# EAGLE design Decoder_35 (EAGLE 9.0.1)
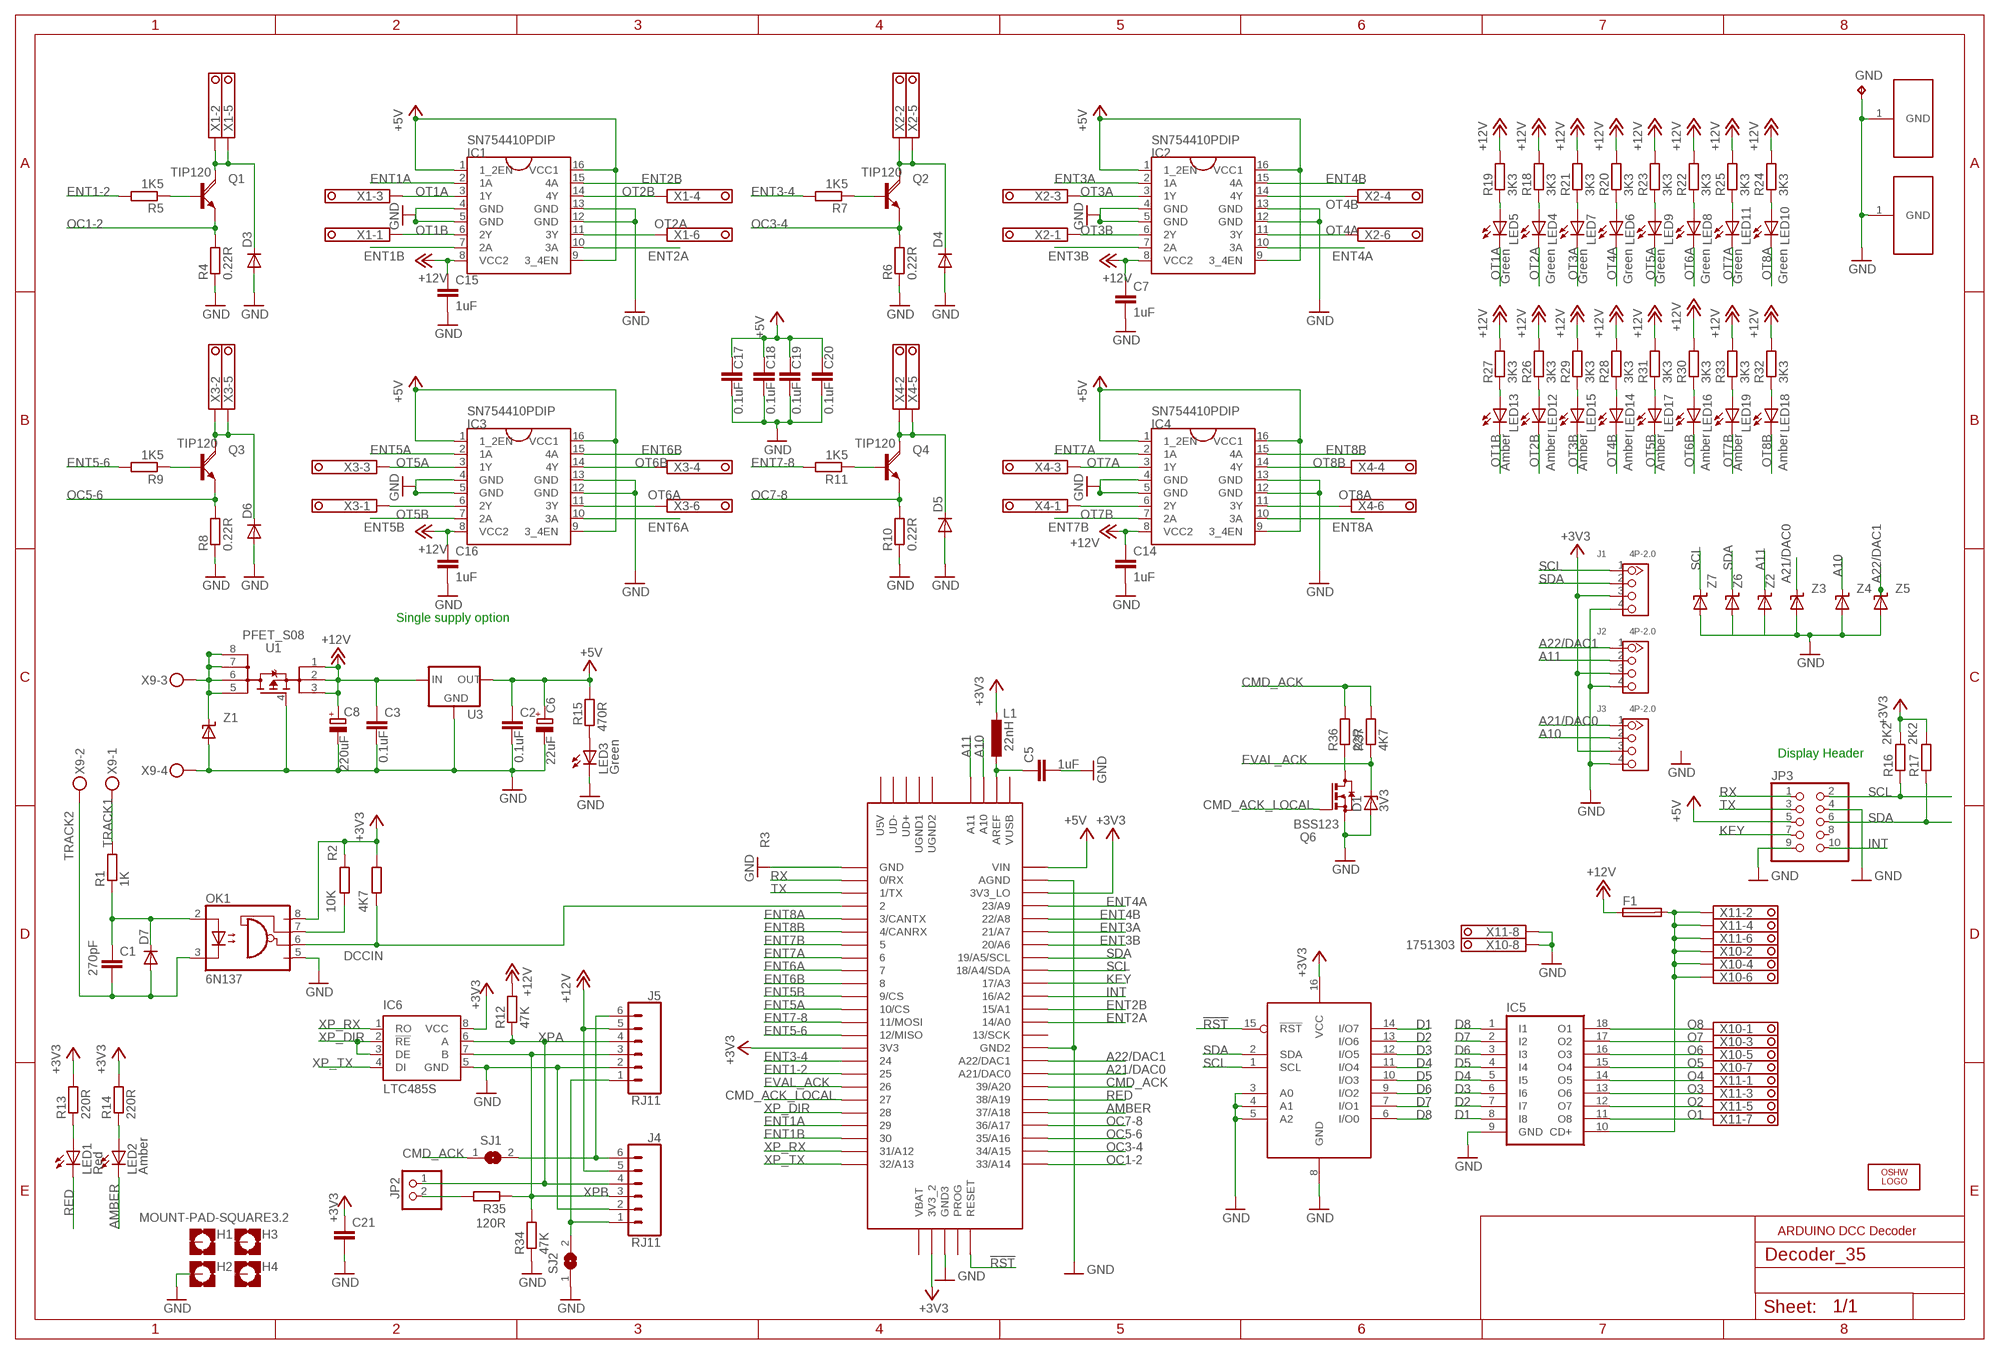
[diagram p0: schematic, sheet 1]

## Parts
C1  270pF  C-EUC0805  [C0805]
C2  0.1uF  C-EUC0805  [C0805]
C3  0.1uF  C-EUC0805  [C0805]
C5  1uF  C-EUC0805  [C0805]
C6  22uF  CPOL-EUE2.5-5  [E2,5-5]
C7  1uF  C-EUC0805  [C0805]
C8  220uF  CPOL-EUE5-8.5  [E5-8,5]
C14  1uF  C-EUC0805  [C0805]
C15  1uF  C-EUC0805  [C0805]
C16  1uF  C-EUC0805  [C0805]
C17  0.1uF  C-EUC0805  [C0805]
C18  0.1uF  C-EUC0805  [C0805]
C19  0.1uF  C-EUC0805  [C0805]
C20  0.1uF  C-EUC0805  [C0805]
C21  C-EUC0805  [C0805]
D1  3V3  ZENER-DIODESOT23  [SOT23]
D3  CGRM4002-G  [SOD-123_MINI-SMA]
D4  CGRM4002-G  [SOD-123_MINI-SMA]
D5  CGRM4002-G  [SOD-123_MINI-SMA]
D6  CGRM4002-G  [SOD-123_MINI-SMA]
D7  CGRM4002-G  [SOD-123_MINI-SMA]
F1  SMD_FUSE  [1812]
GND  TPB2,54  [B2,54]
H1  MOUNT-PAD-SQUARE3.2  [3,2-PAD-SQUARE]
H2  MOUNT-PAD-SQUARE3.2  [3,2-PAD-SQUARE]
H3  MOUNT-PAD-SQUARE3.2  [3,2-PAD-SQUARE]
H4  MOUNT-PAD-SQUARE3.2  [3,2-PAD-SQUARE]
IC1  SN754410PDIP  [DIL16]
IC2  SN754410PDIP  [DIL16]
IC3  SN754410PDIP  [DIL16]
IC4  SN754410PDIP  [DIL16]
IC5  ULN2803A  [DIL18]
IC6  LTC485S  [SOIC8]
J1  4P-2.0  GROVE-CONNECTOR-DIP(4P-2.0)  [HW4-2.0]
J2  4P-2.0  GROVE-CONNECTOR-DIP(4P-2.0)  [HW4-2.0]
J3  4P-2.0  GROVE-CONNECTOR-DIP(4P-2.0)  [HW4-2.0]
J4  RJ11  RJ11-6  [RJ11-6]
J5  RJ11  RJ11-6  [RJ11-6]
JP2  PINHD-1X2  [1X02]
JP3  PINHD-2X5  [2X05]
L1  22nH  L-EUL2012C  [L2012C]
LED1  Red  LED3MM  [LED3MM]
LED2  Amber  LED3MM  [LED3MM]
LED3  Green  LED3MM  [LED3MM]
LED4  Green  LED3MM  [LED3MM]
LED5  Green  LED3MM  [LED3MM]
LED6  Green  LED3MM  [LED3MM]
LED7  Green  LED3MM  [LED3MM]
LED8  Green  LED3MM  [LED3MM]
LED9  Green  LED3MM  [LED3MM]
LED10  Green  LED3MM  [LED3MM]
LED11  Green  LED3MM  [LED3MM]
LED12  Amber  LED3MM  [LED3MM]
LED13  Amber  LED3MM  [LED3MM]
LED14  Amber  LED3MM  [LED3MM]
LED15  Amber  LED3MM  [LED3MM]
LED16  Amber  LED3MM  [LED3MM]
LED17  Amber  LED3MM  [LED3MM]
LED18  Amber  LED3MM  [LED3MM]
LED19  Amber  LED3MM  [LED3MM]
LOGO1  OSHW_LOGO_6MILX0200-NT  [OSHW_6X200_NOTEXT]
MT1  DINC45_MOUNT  [DIN_C45]
MT2  DINC45_MOUNT  [DIN_C45]
OK1  6N137  [DIL08]
Q1  TIP120  [TO220AH]
Q2  TIP120  [TO220AH]
Q3  TIP120  [TO220AH]
Q4  TIP120  [TO220AH]
Q6  BSS123  [SOT23]
R1  1K  R-EU_R0805  [R0805]
R2  10K  R-EU_R0805  [R0805]
R3  4K7  R-EU_R0805  [R0805]
R4  0.22R  R-EU_R2512  [R2512]
R5  1K5  R-EU_R0805  [R0805]
R6  0.22R  R-EU_R2512  [R2512]
R7  1K5  R-EU_R0805  [R0805]
R8  0.22R  R-EU_R2512  [R2512]
R9  1K5  R-EU_R0805  [R0805]
R10  0.22R  R-EU_R2512  [R2512]
R11  1K5  R-EU_R0805  [R0805]
R12  47K  R-EU_R0805  [R0805]
R13  220R  R-EU_R0805  [R0805]
R14  220R  R-EU_R0805  [R0805]
R15  470R  R-EU_R0805  [R0805]
R16  2K2  R-EU_R0805  [R0805]
R17  2K2  R-EU_R0805  [R0805]
R18  3K3  R-EU_R0805  [R0805]
R19  3K3  R-EU_R0805  [R0805]
R20  3K3  R-EU_R0805  [R0805]
R21  3K3  R-EU_R0805  [R0805]
R22  3K3  R-EU_R0805  [R0805]
R23  3K3  R-EU_R0805  [R0805]
R24  3K3  R-EU_R0805  [R0805]
R25  3K3  R-EU_R0805  [R0805]
R26  3K3  R-EU_R0805  [R0805]
R27  3K3  R-EU_R0805  [R0805]
R28  3K3  R-EU_R0805  [R0805]
R29  3K3  R-EU_R0805  [R0805]
R30  3K3  R-EU_R0805  [R0805]
R31  3K3  R-EU_R0805  [R0805]
R32  3K3  R-EU_R0805  [R0805]
R33  3K3  R-EU_R0805  [R0805]
R34  47K  R-EU_R0805  [R0805]
R35  120R  R-EU_R0805  [R0805]
R36  22R  R-EU_R0805  [R0805]
R37  4K7  R-EU_R0805  [R0805]
SJ1  SJ  [SJ]
SJ2  SJ  [SJ]
U1  PFET_S08  [SO08]
U2  PCA9557  [S016]
U3  V_REG_78XX-TO-220  [TO-220-ALT]
U$1  TEENSY_3.5/3.6  [TEENSY_3.5/3.6]
X1  1751280  [1751280]
X2  1751280  [1751280]
X3  1751280  [1751280]
X4  1751280  [1751280]
X9  MKDSN1,5/4-5,08  [MKDSN1,5/4-5,08]
X10  1751303  [1751303]
X11  1751303  [1751303]
Z1  TRANSZORB  [SMB]
Z2  TRANSZORB-SMA  [SMA]
Z3  TRANSZORB-SMA  [SMA]
Z4  TRANSZORB-SMA  [SMA]
Z5  TRANSZORB-SMA  [SMA]
Z6  TRANSZORB-SMA  [SMA]
Z7  TRANSZORB-SMA  [SMA]

## Nets
!RST: U2.15(!RST) U$1.RESET
+3V3 [pwr]: C21.1 IC6.8(VCC) J1.3 J2.3 J3.3 L1.1 OK1.8(VCC) R2.2 R3.2 R13.2 R14.2 R16.2 R17.2 U2.16(VCC) U$1.3V3 U$1.3V3_2 U$1.3V3_LO
+5V: C2.1 C6.+ C17.1 C18.1 C19.1 C20.1 IC1.1(1_2EN) IC1.9(3_4EN) IC1.16(VCC1) IC2.1(1_2EN) IC2.9(3_4EN) IC2.16(VCC1) IC3.1(1_2EN) IC3.9(3_4EN) IC3.16(VCC1) IC4.1(1_2EN) IC4.9(3_4EN) IC4.16(VCC1) JP3.5 R15.2 U3.OUT U$1.VIN
+12V: C3.1 C7.1 C8.+ C14.1 C15.1 C16.1 F1.1 IC1.8(VCC2) IC2.8(VCC2) IC3.8(VCC2) IC4.8(VCC2) J4.5 J5.5 R12.2 R18.2 R19.2 R20.2 R21.2 R22.2 R23.2 R24.2 R25.2 R26.2 R27.2 R28.2 R29.2 R30.2 R31.2 R32.2 R33.2 U1.1(S1) U1.2(S2) U1.3(S3) U3.IN
A10: J3.2 U$1.A10 Z4.C
A11: J2.2 U$1.A11 Z2.C
A21/DAC0: J3.1 U$1.21/DAC0(A21/DAC0) Z3.C
A22/DAC1: J2.1 U$1.A22/DAC1 Z5.C
AMBER: LED2.K(C) U$1.37/A18
CMD_ACK: R36.2 R37.2 SJ1.1 U$1.39/A20
CMD_ACK_LOCAL: Q6.1(G) U$1.27
D1: IC5.8(I8) U2.14(I/O7)
D2: IC5.7(I7) U2.13(I/O6)
D3: IC5.6(I6) U2.12(I/O5)
D4: IC5.5(I5) U2.11(I/O4)
D5: IC5.4(I4) U2.10(I/O3)
D6: IC5.3(I3) U2.9(I/O2)
D7: IC5.2(I2) U2.7(I/O1)
D8: IC5.1(I1) U2.6(I/O0)
DCCIN: OK1.6(VO) R3.1 U$1.2
ENT1-2: R5.2 U$1.25
ENT1A: IC1.2(1A) U$1.29
ENT1B: IC1.7(2A) U$1.30
ENT2A: IC1.10(3A) U$1.14/A0
ENT2B: IC1.15(4A) U$1.15/A1
ENT3-4: R7.2 U$1.24
ENT3A: IC2.2(1A) U$1.21/A7
ENT3B: IC2.7(2A) U$1.20/A6
ENT4A: IC2.10(3A) U$1.23/A9
ENT4B: IC2.15(4A) U$1.22/A8
ENT5-6: R9.2 U$1.12/MISO
ENT5A: IC3.2(1A) U$1.10/CS
ENT5B: IC3.7(2A) U$1.9/CS
ENT6A: IC3.10(3A) U$1.7
ENT6B: IC3.15(4A) U$1.8
ENT7-8: R11.2 U$1.11/MOSI
ENT7A: IC4.2(1A) U$1.6
ENT7B: IC4.7(2A) U$1.5
ENT8A: IC4.10(3A) U$1.3/CANTX
ENT8B: IC4.15(4A) U$1.4/CANRX
EVAL_ACK: D1.3(C) R37.1 U$1.26
GND: C2.2 C3.2 C5.2 C6.- C7.2 C8.- C14.2 C15.2 C16.2 C17.2 C18.2 C19.2 C20.2 C21.2 D1.1(A) D3.A D4.A D5.A D6.A GND.TP H2.B3,2(MOUNT) IC1.4(GND) IC1.5(GND) IC1.12(GND) IC1.13(GND) IC2.4(GND) IC2.5(GND) IC2.12(GND) IC2.13(GND) IC3.4(GND) IC3.5(GND) IC3.12(GND) IC3.13(GND) IC4.4(GND) IC4.5(GND) IC4.12(GND) IC4.13(GND) IC5.9(GND) IC6.5(GND) J1.4 J2.4 J3.4 J4.2 J5.2 JP3.4 JP3.9 LED3.K(C) MT1.1(GND) MT2.1(GND) OK1.5(GND) Q6.2(S) R4.1 R6.1 R8.1 R10.1 R34.1 SJ2.1 U1.4(G) U2.3(A0) U2.4(A1) U2.5(A2) U2.8(GND) U3.GND U$1.AGND U$1.GND U$1.GND2 U$1.GND3 X9.4 X10.8 X11.8 Z1.2(A) Z2.A Z3.A Z4.A Z5.A Z6.A Z7.A
INT: JP3.10 U$1.16/A2
KEY: JP3.7 U$1.17/A3
N$1: C5.1 L1.2 U$1.AREF
N$2: C1.1 D7.C OK1.2(A) R1.1
N$3: U1.5(D4) U1.6(D3) U1.7(D2) U1.8(D1) X9.3 Z1.1(C)
N$4: OK1.7(VE) R2.1
N$5: Q2.B R7.1
N$7: Q1.B R5.1
N$8: D3.C Q1.C X1.2 X1.5
N$9: LED5.A R19.1
N$10: J4.1 J5.1 SJ2.2
N$11: Q6.3(D) R36.1
N$12: D4.C Q2.C X2.2 X2.5
N$13: LED6.A R20.1
N$14: LED7.A R21.1
N$15: LED8.A R22.1
N$16: LED9.A R23.1
N$17: LED10.A R24.1
N$18: LED11.A R25.1
N$19: LED12.A R26.1
N$20: Q3.B R9.1
N$22: D6.C Q3.C X3.2 X3.5
N$23: LED13.A R27.1
N$24: LED14.A R28.1
N$25: LED15.A R29.1
N$26: LED16.A R30.1
N$27: Q4.B R11.1
N$28: J4.6 J5.6 SJ1.2
N$29: D5.C Q4.C X4.2 X4.5
N$30: LED17.A R31.1
N$31: LED18.A R32.1
N$32: LED19.A R33.1
N$33: JP2.2 R35.2
N$38: F1.2 IC5.10(CD+) X10.2 X10.4 X10.6 X11.2 X11.4 X11.6
N$42: LED3.A R15.1
N$43: LED1.A R13.1
N$44: LED2.A R14.1
N$47: LED4.A R18.1
O1: IC5.11(O8) X11.7
O2: IC5.12(O7) X11.5
O3: IC5.13(O6) X11.3
O4: IC5.14(O5) X11.1
O5: IC5.15(O4) X10.7
O6: IC5.16(O3) X10.5
O7: IC5.17(O2) X10.3
O8: IC5.18(O1) X10.1
OC1-2: Q1.E R4.2 U$1.33/A14
OC3-4: Q2.E R6.2 U$1.34/A15
OC5-6: Q3.E R8.2 U$1.35/A16
OC7-8: Q4.E R10.2 U$1.36/A17
OT1A: IC1.3(1Y) LED5.K(C) X1.3
OT1B: IC1.6(2Y) LED13.K(C) X1.1
OT2A: IC1.11(3Y) LED4.K(C) X1.6
OT2B: IC1.14(4Y) LED12.K(C) X1.4
OT3A: IC2.3(1Y) LED7.K(C) X2.3
OT3B: IC2.6(2Y) LED15.K(C) X2.1
OT4A: IC2.11(3Y) LED6.K(C) X2.6
OT4B: IC2.14(4Y) LED14.K(C) X2.4
OT5A: IC3.3(1Y) LED9.K(C) X3.3
OT5B: IC3.6(2Y) LED17.K(C) X3.1
OT6A: IC3.11(3Y) LED8.K(C) X3.6
OT6B: IC3.14(4Y) LED16.K(C) X3.4
OT7A: IC4.3(1Y) LED11.K(C) X4.3
OT7B: IC4.6(2Y) LED19.K(C) X4.1
OT8A: IC4.11(3Y) LED10.K(C) X4.6
OT8B: IC4.14(4Y) LED18.K(C) X4.4
RED: LED1.K(C) U$1.38/A19
RX: JP3.1 U$1.0/RX
SCL: J1.1 JP3.2 R16.1 U2.1(SCL) U$1.18/A4/SDA Z7.C
SDA: J1.2 JP3.6 R17.1 U2.2(SDA) U$1.19/A5/SCL Z6.C
TRACK1: R1.2 X9.1
TRACK2: C1.2 D7.A OK1.3(C) X9.2
TX: JP3.3 U$1.1/TX
XP_DIR: IC6.2(!RE) IC6.3(DE) U$1.28
XP_RX: IC6.1(RO) U$1.31/A12
XP_TX: IC6.4(DI) U$1.32/A13
XPA: IC6.6(A) J4.4 J5.4 JP2.1 R12.1
XPB: IC6.7(B) J4.3 J5.3 R34.2 R35.1
Unconnected: H1.B3,2(MOUNT) H3.B3,2(MOUNT) H4.B3,2(MOUNT) JP3.8 U$1.13/SCK U$1.PROG U$1.U5V U$1.UD+ U$1.UD- U$1.UGND1 U$1.UGND2 U$1.VBAT U$1.VUSB

## Notes on the sheet
- Single supply option
- Display Header
- ARDUINO DCC Decoder

## Library data of the parts
C1-C3 C5 C7 C14-C20 = rcl:C-EU: CAPACITOR, European symbol; SPICEPREFIX: C
C6 C8 = rcl:CPOL-EU: POLARIZED CAPACITOR, European symbol; SPICEPREFIX: C
C21 = rcl:C-EU: CAPACITOR, European symbol
D1 = diode:ZENER-DIODE: Z-Diode
D3-D7 = diode:CGRM400*-G: Molded plasitc,JEDEC SOD-123/Mini SMA Source: Comchip CGRM4001-G.pdf
F1 = GJR:SMD_FUSE: SMD Resettable Fuse; FARNELL: 1597001; MANUFACTURER: Littelfuse; RATING: 500mA
GND = testpad:TP: Test pad
H1-H4 = holes:MOUNT-PAD-SQUARE: MOUNTING PAD, square
IC1-IC4 = AlexW-Eagle-Libraries:SN754410
IC5 = uln-udn:ULN2803A: DRIVER ARRAY
IC6 = linear-technology:LTC485: Low Power RS485 Interface Transceiver Source: http://www.linear.com/pc/downloadDocument.do?navId=H0,C1,C1007,C1017,P2064,D1718; OC_FARNELL: unknown; OC_NEWARK: unknown
J1-J3 = Seeed-Connector:GROVE-CONNECTOR-DIP(4P-2.0): 320110033
J4 J5 = SparkFun-Connectors:RJ11-6: RJ11 Jack - 6 pin Commonly found on CAT3 devices and some Microchip programmers. Here is the connector we sell at SparkFun: RJ11 6-Pin Connector <https://www.sparkfun.com/products/132> (PRT-00132) Datasheet <http://www.sparkfun.com/datasheets/Prototyping/Connectors/RJ11-Datasheet.pdf> It is used on this SparkFun product: SparkFun Weather Shield <https://www.sparkfun.com/products/12081> (DEV-12081) Weather Meters <https://www.sparkfun.com/products/8942> (SEN-08942); PROD_ID: CONN-08590; SF_ID: PRT-00132
JP2 = pinhead:PINHD-1X2: PIN HEADER
JP3 = pinhead:PINHD-2X5: PIN HEADER
L1 = rcl:L-EU: INDUCTOR, European symbol; SPICEPREFIX: L
LED1-LED19 = adafruit:LED: LED OSRAM: - CHIPLED LG R971, LG N971, LY N971, LG Q971, LY Q971, LO R971, LY R971 LH N974, LH R974 LS Q976, LO Q976, LY Q976 LO Q996 - Hyper CHIPLED LW Q18S LB Q993, LB Q99A, LB R99A - SideLED LS A670, LO A670, LY A670, LG A670, LP A670 LB A673, LV A673, LT A673, LW A673 LH A674 LY A675 LS A676, LA A676, LO A676, LY A676, LW A676 LS A679, LY A679, LG A679 - Hyper Micro SIDELED® LS Y876, LA Y876, LO Y876, LY Y876 LT Y87S - SmartLED LW L88C, LW L88S LB L89C, LB L89S, LG L890 LS L89K, LO L89K, LY L89K LS L896, LA L896, LO L896, LY L896 - TOPLED LS T670, LO T670, LY T670, LG T670, LP T670 LSG T670, LSP T670, LSY T670, LOP T670, LYG T670 LG T671, LOG T671, LSG T671 LB T673, LV T673, LT T673, LW T673 LH T674 LS T676, LA T676, LO T676, LY T676, LB T676, LH T676, LSB T676, LW T676 LB T67C, LV T67C, LT T67C, LS T67K, LO T67K, LY T67K, LW E67C LS E67B, LA E67B, LO E67B, LY E67B, LB E67C, LV E67C, LT E67C LW T67C LS T679, LY T679, LG T679 LS T770, LO T770, LY T770, LG T770, LP T770 LB T773, LV T773, LT T773, LW T773 LH T774 LS E675, LA E675, LY E675, LS T675 LS T776, LA T776, LO T776, LY T776, LB T776 LHGB T686 LT T68C, LB T68C - Hyper Mini TOPLED® LB M676 - Mini TOPLED Santana® LG M470 LS M47K, LO M47K, LY M47K Source: http://www.osram.convergy.de/
LOGO1 = ohw-logo:OSHW_LOGO_6MIL
MT1 MT2 = GJR:DINC45_MOUNT: DIN Rail C45 Mount
OK1 = optocoupler:6N137: MOTOROLA OPTO COUPLER; MPN: 6N137; OC_FARNELL: 1328376; OC_NEWARK: 52M1895
Q1-Q4 = transistor-power:TIP120: NPN DARLINGTON TRANSISTOR
Q6 = transistor-small-signal:BSS123: N-CHANNEL MOS FET
R1-R11 R13-R33 = rcl:R-EU_: RESISTOR, European symbol; SPICEPREFIX: R
R12 R34-R37 = rcl:R-EU_: RESISTOR, European symbol
SJ1 SJ2 = jumper:SJ: SMD solder JUMPER
U1 = GJR:PFET_S08: SO8 PFET; FARNELL: 2579999; MANUFACTURER: Infineon; PARTNUMBER: IRF9388TRFPBF
U2 = GJR:PCA9557: 8 bit I2C I/O port with Reset
U3 = SparkFun-IC-Power:V_REG_78XX: Voltage Regulator Standard 78xx regulator. IGO (Input Ground Output). Spark Fun Electronics SKU : COM-00107; PROD_ID: VREG-08450; SF_ID: COM-00107
U$1 = Teensy356:TEENSY_3.5/3.6
X1-X4 = con-phoenix-350:1751280: MKDS 1/ 6-3,5 Printklemme Nennstrom: 10 A Bemessungsspannung: 160 V Raster: 3,5 mm Polzahl: 6 Montageart: Löten Anschlussart: Schraubanschluss Anschlussrichtung vom Leiter zur Platine: 0° Source: http://eshop.phoenixcontact.com .. 1751280.pdf; MPN: 1751280; OC_FARNELL: unknown; OC_NEWARK: 27R1765
X9 = con-phoenix-508:MKDSN1,5/4-5,08: MKDSN 1,5/ 4-5,08 Printklemme Nennstrom: 13,5 A Nennspannung: 250 V Rastermaß: 5,08 mm Polzahl: 4 Anschlussart: Schraubanschluss Montage: Löten Anschlussrichtung Leiter/Platine: 0 ° Artikelnummer: 1729144 Source: http://eshop.phoenixcontact.com .. 1729144.pdf
X10 X11 = con-phoenix-350:1751303: MKDS 1/ 8-3,5 Printklemme Nennstrom: 10 A Bemessungsspannung: 160 V Raster: 3,5 mm Polzahl: 8 Montageart: Löten Anschlussart: Schraubanschluss Anschlussrichtung vom Leiter zur Platine: 0° Source: http://eshop.phoenixcontact.com .. .pdf; OC_FARNELL: unknown; OC_NEWARK: unknown
Z1 = GJR:TRANSZORB; VOLTAGE: 15V
Z2-Z7 = GJR:TRANSZORB-SMA: SMA uni-directional Transzorb

## Net classes
0 default: clearance 0.205 mm
1 pwr: width 0.2 mm, drill 0.3 mm, clearance 0.205 mm to class 0, clearance 0.205 mm

## Board
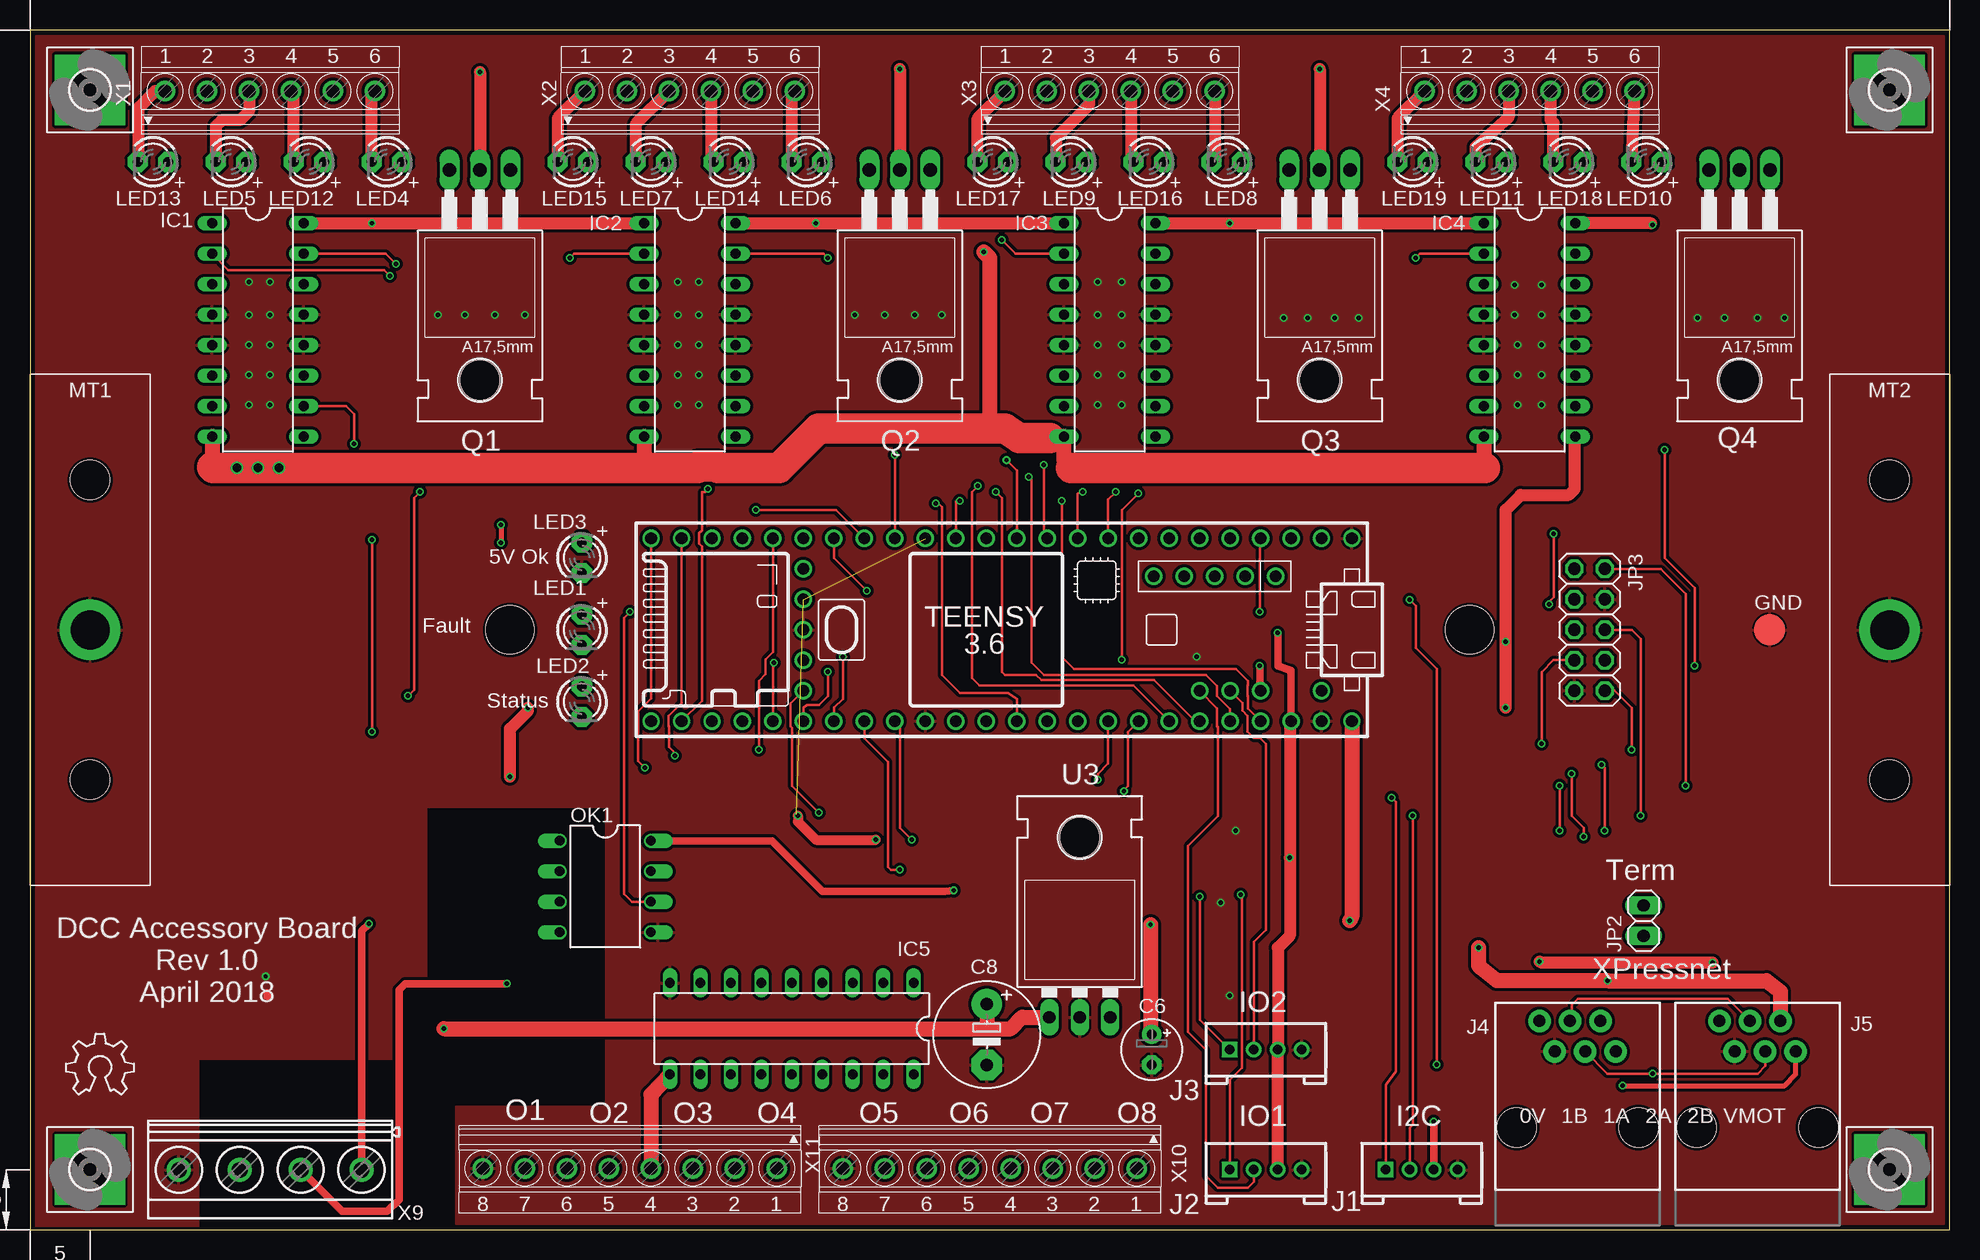
[diagram p1: board, top side]
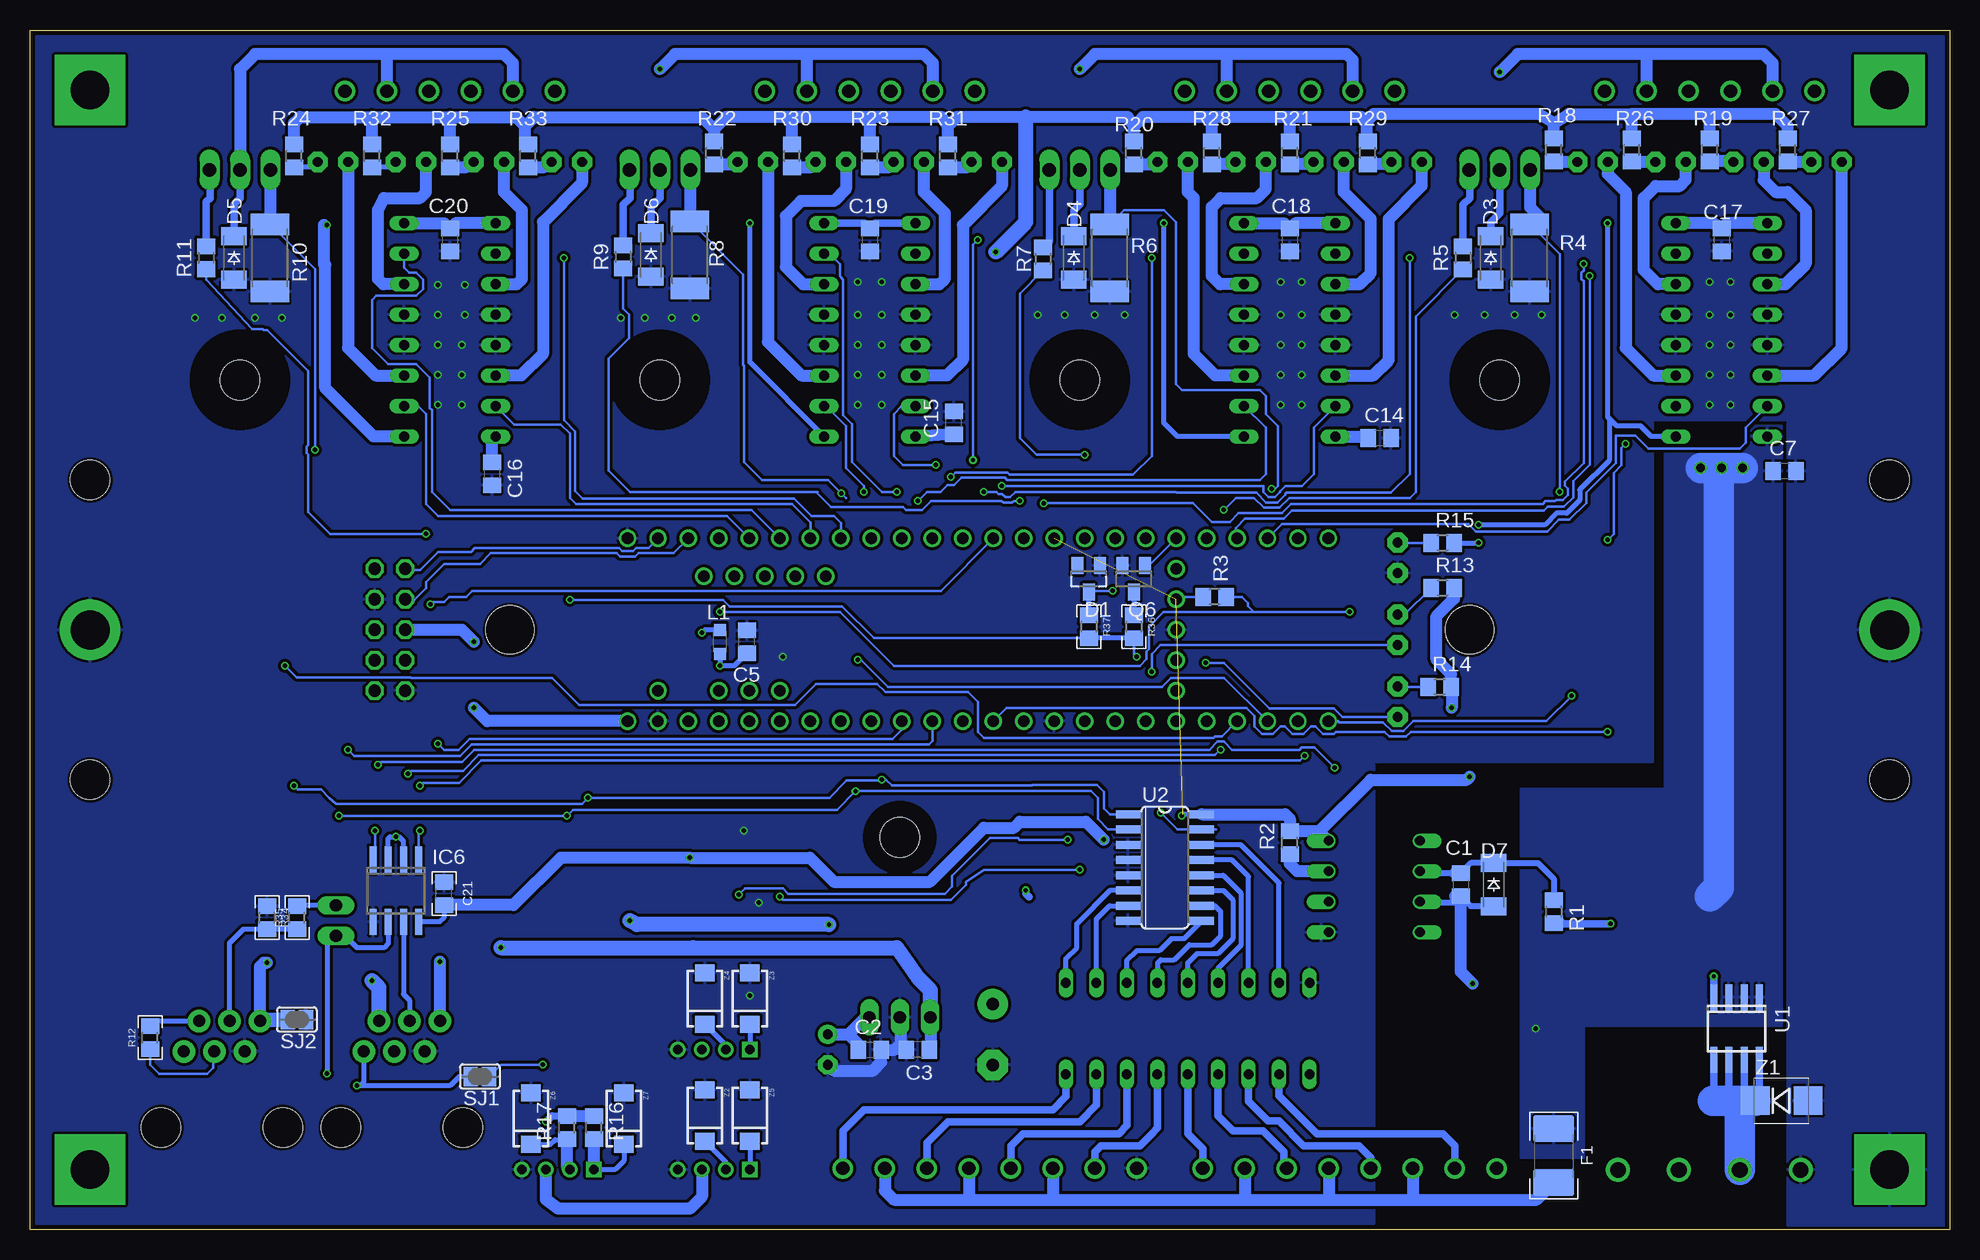
[diagram p2: board, bottom side, seen from below]

Size 160 x 100 mm. Coordinates in mm from the lower left corner, seen from the top.
Outline: 0,0 160,0 160,100 0,100 0,0
Copper layers (1*16): Top 0.07mm / dielectric 1.55mm / Bottom 0.07mm
Design rules "eC_2Layer_PClass4_BaseCopperO70": minimum track width 0.2mm, minimum drill 0.35mm, track to track 0.25mm, track to pad 0.25mm, pad to pad 0.25mm, via to via 0.25mm, smd to smd 0mil, copper to edge 0.25mm, drill to drill 0.35mm, minimum pad ring 0.2mm, minimum via ring 0.15mm, stop-mask expansion 0mil, vias tented up to drill 0.45mm, thermal gap 0.2mm
Holes 4 mm at 40,50 120,50

### Footprints (pad centres in the part's own frame; a part is rotated, then mirrored left to right if it is on the bottom)
C0805 = smd 1.3 x 1.5: 1 -0.95,0; 2 0.95,0
E2,5-5 = drill 0.813 pad 1.6: + -1.27,0 | drill 0.813 pad 1.6 octagon: - 1.27,0
E5-8,5 = drill 1.016 pad 2.54: + -2.54,0 | drill 1.016 pad 2.54 octagon: - 2.54,0
SOT23 = smd 1 x 1.4: 1 -0.95,-1.1; 2 0.95,-1.1; 3 0,1.1
SOD-123_MINI-SMA = smd 1.5 x 2.1: A 1.8,0; C -1.8,0
1812 = smd 2.25 x 3.4: 1 -2.25,0; 2 2.25,0
B2,54 = smd 2.54 x 2.54: TP 0,0
3,2-PAD-SQUARE = drill 3.2 pad 5.842 square: B3,2 0,0
DIL16 = drill 0.813 long: 1 -8.89,-3.81; 2 -6.35,-3.81; 3 -3.81,-3.81; 4 -1.27,-3.81; 5 1.27,-3.81; 6 3.81,-3.81; 7 6.35,-3.81; 8 8.89,-3.81; 9 8.89,3.81; 10 6.35,3.81; 11 3.81,3.81; 12 1.27,3.81; 13 -1.27,3.81; 14 -3.81,3.81; 15 -6.35,3.81; 16 -8.89,3.81
DIL18 = drill 0.813 long: 1 -10.16,-3.81; 2 -7.62,-3.81; 3 -5.08,-3.81; 4 -2.54,-3.81; 5 0,-3.81; 6 2.54,-3.81; 7 5.08,-3.81; 8 7.62,-3.81; 9 10.16,-3.81; 10 10.16,3.81; 11 7.62,3.81; 12 5.08,3.81; 13 2.54,3.81; 14 0,3.81; 15 -2.54,3.81; 16 -5.08,3.81; 17 -7.62,3.81; 18 -10.16,3.81
SOIC8 = smd 0.6 x 2.2: 1 -1.905,-2.6; 2 -0.635,-2.6; 3 0.635,-2.6; 4 1.905,-2.6; 5 1.905,2.6; 6 0.635,2.6; 7 -0.635,2.6; 8 -1.905,2.6
HW4-2.0 = drill 0.8 pad 1.27 square: 1 -3,0 | drill 0.8 pad 1.27: 2 -1,0; 3 1,0; 4 3,0
RJ11-6 = drill 1.016 pad 1.88: 1 -3.175,8.89; 2 -1.905,6.35; 3 -0.635,8.89; 4 0.635,6.35; 5 1.905,8.89; 6 3.175,6.35 | hole 3.251: -5.08,0; 5.08,0
1X02 = drill 1.016 long: 1 -1.27,0; 2 1.27,0
2X05 = drill 1.016 octagon: 1 -5.08,-1.27; 2 -5.08,1.27; 3 -2.54,-1.27; 4 -2.54,1.27; 5 0,-1.27; 6 0,1.27; 7 2.54,-1.27; 8 2.54,1.27; 9 5.08,-1.27; 10 5.08,1.27
L2012C = smd 1 x 1: 1 -1,0; 2 1,0
LED3MM = drill 0.813 pad 1.676 octagon: A -1.27,0; K 1.27,0
DIN_C45 = drill 3.25 pad 5.08: 1 0,0 | hole 3.25: 0,12.5; 0,-12.5
DIL08 = drill 0.813 offset: 1 -3.81,-3.81; 2 -1.27,-3.81; 3 1.27,-3.81; 4 3.81,-3.81; 5 3.81,3.81; 6 1.27,3.81; 7 -1.27,3.81; 8 -3.81,3.81
TO220AH = drill 1.118 long: B -2.54,-6.35; C 0,-6.35; E 2.54,-6.35 | hole 3.302: 0,11.176
R0805 = smd 1.3 x 1.5: 1 -0.95,0; 2 0.95,0
R2512 = smd 1.8 x 3.2: 1 -2.8,0; 2 2.8,0
SJ = smd 1.168 x 1.6: 1 -0.762,0; 2 0.762,0
SO08 = smd 0.6 x 2.2: 1 -1.905,-2.6; 2 -0.635,-2.6; 3 0.635,-2.6; 4 1.905,-2.6; 5 1.905,2.6; 6 0.635,2.6; 7 -0.635,2.6; 8 -1.905,2.6
S016 = smd 0.66 x 2.032: 1 -4.445,-3.073; 2 -3.175,-3.073; 3 -1.905,-3.073; 4 -0.635,-3.073; 5 0.635,-3.073; 6 1.905,-3.073; 7 3.175,-3.073; 8 4.445,-3.073; 9 4.445,3.073; 10 3.175,3.073; 11 1.905,3.073; 12 0.635,3.073; 13 -0.635,3.073; 14 -1.905,3.073; 15 -3.175,3.073; 16 -4.445,3.073
TO-220-ALT = drill 1.016 long: GND 0,-3.81; IN -2.54,-3.81; OUT 2.54,-3.81 | hole 3.302: 0,11.176
TEENSY_3.5/3.6 = drill 0.965: 0/RX -25.4,-7.62; 1/TX -22.86,-7.62; 2 -20.32,-7.62; 3/CANTX -17.78,-7.62; 3V3 7.62,-7.62; 3V3_2 17.78,-2.54; 3V3_LO -22.86,7.62; 4/CANRX -15.24,-7.62; 5 -12.7,-7.62; 6 -10.16,-7.62; 7 -7.62,-7.62; 8 -5.08,-7.62; 9/CS -2.54,-7.62; 10/CS 0,-7.62; 11/MOSI 2.54,-7.62; 12/MISO 5.08,-7.62; 13/SCK 5.08,7.62; 14/A0 2.54,7.62; 15/A1 0,7.62; 16/A2 -2.54,7.62; 17/A3 -5.08,7.62; 18/A4/SDA -7.62,7.62; 19/A5/SCL -10.16,7.62; 20/A6 -12.7,7.62; 21/A7 -15.24,7.62; 21/DAC0 12.7,7.62; 22/A8 -17.78,7.62; 23/A9 -20.32,7.62; 24 10.16,-7.62; 25 12.7,-7.62; 26 15.24,-7.62; 27 17.78,-7.62; 28 20.32,-7.62; 29 22.86,-7.62; 30 25.4,-7.62; 31/A12 27.94,-7.62; 32/A13 30.48,-7.62; 33/A14 30.48,7.62; 34/A15 27.94,7.62; 35/A16 25.4,7.62; 36/A17 22.86,7.62; 37/A18 20.32,7.62; 38/A19 17.78,7.62; 39/A20 15.24,7.62; A10 -17.78,5.08; A11 -15.24,5.08; A22/DAC1 10.16,7.62; AGND -25.4,7.62; AREF -20.32,5.08; GND -27.94,-7.62; GND2 7.62,7.62; GND3 17.78,0; PROG 17.78,2.54; RESET 17.78,5.08; U5V -21.59,-4.445; UD+ -16.51,-4.445; UD- -19.05,-4.445; UGND1 -13.97,-4.445; UGND2 -11.43,-4.445; VBAT 17.78,-5.08; VIN -27.94,7.62; VUSB -25.4,5.08
1751280 = drill 1.1 pad 1.7: 1 -8.75,-0.1; 2 -5.25,-0.1; 3 -1.75,-0.1; 4 1.75,-0.1; 5 5.25,-0.1; 6 8.75,-0.1
MKDSN1,5/4-5,08 = drill 1.3 pad 2: 1 -7.641,0.025; 2 -2.561,0.025; 3 2.519,0.025; 4 7.599,0.025
1751303 = drill 1.1 pad 1.7: 1 -12.25,-0.1; 2 -8.75,-0.1; 3 -5.25,-0.1; 4 -1.75,-0.1; 5 1.75,-0.1; 6 5.25,-0.1; 7 8.75,-0.1; 8 12.25,-0.1
SMB = smd 2.4 x 2.4: 1 -2.2,0; 2 2.2,0
SMA = smd 1.4 x 1.64: A -2.15,0; C 2.15,0

### Placement (x,y rotation side)
C1  40.75,28.75 270 bottom
C2  90,15 0 bottom
C3  86,15 180 bottom
C5  100.25,49 90 bottom
C6  93.5,15 270 top
C7  13.75,63.25 0 bottom
C8  79.75,16.25 270 top
C14  47.5,66 0 bottom
C15  83,67.25 90 bottom
C16  121.5,63 270 bottom
C17  19,82.5 270 bottom
C18  55,82.5 270 bottom
C19  90,82.5 270 bottom
C20  125,82.5 270 bottom
C21  125.5,28 90 bottom
D1  71.75,54.25 180 bottom
D3  38.25,81 270 bottom
D4  73,81 270 bottom
D5  143,81 270 bottom
D6  108.25,81.25 270 bottom
D7  38,28.75 270 bottom
F1  33,6.16 270 bottom
GND  145,50 0 top
H1  5,95 0 top
H2  5,5 0 top
H3  155,95 0 top
H4  155,5 0 top
IC1  19,75 270 top
IC2  55,75 270 top
IC3  90,75 270 top
IC4  125,75 270 top
IC5  63.5,16.75 180 top
IC6  129.5,28.25 180 bottom
J1  116,5 0 top
J2  103,5 0 top
J3  103,15 0 top
J4  129,8.5 0 top
J5  144,8.5 0 top
JP2  134.5,25.75 90 top
JP3  130,50 270 top
L1  102.5,49 270 bottom
LED1  46,50 270 top
LED2  46,44 270 top
LED3  46,56 270 top
LED4  29.75,89 180 top
LED5  16.75,89 180 top
LED6  64.75,89 180 top
LED7  51.75,89 180 top
LED8  99.75,89 180 top
LED9  86.75,89 180 top
LED10  134.75,89 180 top
LED11  121.75,89 180 top
LED12  23.25,89 180 top
LED13  10.25,89 180 top
LED14  58.25,89 180 top
LED15  45.25,89 180 top
LED16  93.25,89 180 top
LED17  80.25,89 180 top
LED18  128.25,89 180 top
LED19  115.25,89 180 top
LOGO1  3,11.25 0 top
MT1  5,50 0 top
MT2  155,50 0 top
OK1  47.95,28.6 270 top
Q1  37.5,82 180 top
Q2  72.5,82 180 top
Q3  107.5,82 180 top
Q4  142.5,82 180 top
Q6  68,54.25 180 bottom
R1  33,26.5 270 bottom
R2  55,32.25 90 bottom
R3  61.25,52.75 180 bottom
R4  35,81 90 bottom
R5  40.57,81 270 bottom
R6  70,81 90 bottom
R7  75.57,80.92 270 bottom
R8  105,81.25 90 bottom
R9  110.57,81.09 270 bottom
R10  140,81 90 bottom
R11  145.32,81.01 270 bottom
R12  150,16 90 bottom
R13  42.25,53.5 0 bottom
R14  42.5,45.25 0 bottom
R15  42.25,57.25 0 bottom
R16  113,8.5 90 bottom
R17  115.25,8.5 90 bottom
R18  33,90 90 bottom
R19  20,90 90 bottom
R20  68,89.75 90 bottom
R21  55,89.75 90 bottom
R22  103,89.75 90 bottom
R23  90,89.5 90 bottom
R24  138,89.5 90 bottom
R25  125,89.5 90 bottom
R26  26.5,90 90 bottom
R27  13.5,90 90 bottom
R28  61.5,89.75 90 bottom
R29  48.5,89.75 90 bottom
R30  96.5,89.5 90 bottom
R31  83.5,89.5 90 bottom
R32  131.5,89.5 90 bottom
R33  118.5,89.5 90 bottom
R34  140.25,26 270 bottom
R35  137.75,26 90 bottom
R36  68,50.25 270 bottom
R37  71.75,50.25 270 bottom
SJ1  122.5,12.75 180 bottom
SJ2  137.75,17.5 180 bottom
U1  17.75,16.75 180 bottom
U2  65.4,30.17 270 bottom
U3  87.5,21.5 0 top
U$1  82.25,50 180 top
X1  20,95 0 top
X2  55,95 0 top
X3  90,95 0 top
X4  125,95 0 top
X9  20,5 180 top
X10  80,5 180 top
X11  50,5 180 top
Z1  14,10.75 0 bottom
Z2  103.75,9.5 270 bottom
Z3  100,19.25 270 bottom
Z4  103.75,19.25 270 bottom
Z5  100,9.5 270 bottom
Z6  118.25,9.25 270 bottom
Z7  110.5,9.25 270 bottom

### Tracks (layer width: path | path; a pad name or v marks a point on that pad's centre or on a via)
!RST  (via drill 0.35)
  Top 0.2: U$1.RESET 63.4,43.85 63.4,41.94 63.5,41.83 63.5,37 v65.75,34.75
  Bottom 0.2: 61.16,33.34 U2.15 64.34,33.34 v65.75,34.75
+3V3  (via drill 0.35)  (2 unrouted)
  Top 0.61: J1.3 v117,9 | 105,42.27 U$1.3V3_LO 105.11,46.61 104,47 v104,49.75 | OK1.8 61.84,32.41 66.06,28.19 76.25,28.19 v77,28.26
  Top 0.813: v64,34.5 64,34 65.5,32.5 v70.5,32.5
  Top 1.016: J2.3 J3.3 104,23.5 105,24.5 v105,31 105,42.27 | v40,37.75 40,41.75 41.5,43.25 v41.5,43.5
  Bottom 0.2: R3.2 64.26,52.75 U$1.3V3_2
  Bottom 0.406: U2.16 63.88,34.62 v64,34.5 | C21.1 125.5,26 125.85,25.65 IC6.8 | L1.1 103.75,50 v104,49.75
  Bottom 0.61: v117,9 116.5,9.5 115.45,9.45 R17.2 | 76.75,27.75 77,28 v77,28.26
  Bottom 1.016: J2.3 104,2.75 105,1.75 116,1.75 117,2.5 J1.3 | R16.2 R17.2 | v70.5,32.5 72,34 77.5,34 78,33.5 80.5,33.5 85,29 93,29 95,31 v105,31 115.75,31 119.7,27.05 C21.1 | 52.55,33.2 R2.2 55,34.25 55.37,34.62 U2.16 | OK1.8 52.55,33.2 | 52.55,33.2 48.25,37.5 40.25,37.5 v40,37.75 | v41.5,43.5 41.5,45.2 R14.2 41.55,46.3 42.76,47.51 42.76,51.14 41.3,52.6 R13.2
+5V  (via drill 0.35)
  Top 0.406: v135.25,83.75 135.11,83.89 | v39.25,58.75 v39.25,57.25
  Top 1.016: IC1.16 v28.5,83.89 IC2.1 | IC2.16 v65.5,83.89 IC3.1 | IC3.16 v100,83.89 IC4.1 | 135.11,83.89 IC4.16 | v123,43.5 v123,49 123,60 124.25,61.25 128.25,61.25 128.75,61.75 128.75,66.05 IC4.9
  Top 1.27: U$1.VIN 110.19,26.19 v110,25.75 | v93.4,25.42 93.4,16.37 C6.+
  Bottom 0.406: IC2.9 64.36,66.11 65.5,67.25 v65.5,83.89 | 28.5,84 v28.5,83.89 28.5,67.75 28.38,67.62 | IC3.9 100,72.3 v100,83.89 100,84 | 135.5,83.75 v135.25,83.75 | R15.2 v39.25,57.25 | IC1.9 24.86,66.11 25.75,67 27.75,67 28.38,67.62 | 28.38,67.62 28.38,64.12 30.82,61.68 30.82,60.8 31.9,59.72 32.78,59.72 33.75,58.75 v39.25,58.75
  Bottom 0.61: 54.56,83.89 C18.1 55.44,83.89 | IC3.1 89.56,83.89 C19.1 90.44,83.89 IC3.16 | 124.56,83.89 C20.1 125.44,83.89
  Bottom 1.016: IC1.1 18.56,83.89 C17.1 19.69,83.89 IC1.16 | IC2.1 54.56,83.89 | IC2.16 55.44,83.89 | IC4.1 124.56,83.89 | IC4.16 125.44,83.89 | IC4.9 131.36,66.11 135.39,70.14 135.39,80.41 135.5,80.51 135.5,83.75 | U$1.VIN 121.88,42.38 v123,43.5 | v123,49 124,50 JP3.5 | C6.+ 91.77,16.27 | C2.1 90.95,15.45 91.77,16.27 | U3.OUT 89.98,18.06 91.77,16.27
  Bottom 1.27: v93.4,25.42 109.42,25.42 v110,25.75
+12V  (via drill 0.35, 0.7)
  Top 1.27: IC1.8 15.19,63.56 | IC2.8 51.19,63.69 51,63.5 | 86.75,63.5 86.19,64.06 IC3.8 85.11,66.11 85,66 | IC4.8 121.19,63.56 121.25,63.5 | 80,66.79 80,81 v79.5,81.5 | v34.5,16.75 79.75,16.75 | C8.+ 79.75,16.75 | U3.IN 82.69,17.69 81.75,16.75 79.75,16.75 | J5.5 145.91,19.84 144.75,20.75 v131.5,20.75 122.25,20.75 121,21.75 120.75,22 v120.75,23.5
  Top 2.54: 15.19,63.56 15.25,63.5 v19,63.5 51,63.5 55.64,63.5 55.74,63.59 57.26,63.59 57.36,63.5 62.44,63.5 65.72,66.79 80,66.79 81.28,66.79 82.49,66 85,66 | 121.25,63.5 86.75,63.5
  Bottom 0.2: R12.2 149.56,17.39
  Bottom 0.406: 149.56,17.39 J5.5
  Bottom 1.016: R27.2 13.5,92 14.5,93 20,93 | 20,93 26.5,93 | 26.5,93 31.75,93 33,92.25 | R19.2 20,93 | R26.2 26.5,93 | R18.2 33,92.25 | 131.5,92.75 137.5,92.75 138,92.25 R24.2 | 131.5,92.75 125,92.75 | 125,92.75 119.5,92.75 118.75,92 | 83.5,92 84,92.75 90.25,92.75 | 90.25,92.75 96.25,92.75 | 96.25,92.75 102,92.75 103,91.75 | 90.25,92.75 90,92.25 R23.2 | 48.5,92.25 48.62,92.38 | 48.62,92.38 49,92.75 55,92.75 | 68,92 67.25,92.75 61.5,92.75 | 55,92.75 61.5,92.75 | 33,92.25 34.25,93 48,93 48.62,92.38 | 68,92 68.5,92.75 77,92.75 82.75,92.75 83.5,92 | 118.75,92 118,92.75 104,92.75 103,91.75 | IC1.8 15.06,66.11 | IC2.8 48.56,66.11 C14.1 | C15.1 86.06,66.11 IC3.8 | IC4.8 121.56,66.11 C16.1 | 48.62,92.38 48.62,90.83 R29.2 | R21.2 55,92.75 | R28.2 61.5,92.75 | R20.2 68,92 | R31.2 83.5,92 | R30.2 96.5,92.5 96.25,92.75 | 103,91.75 R22.2 | R33.2 118.75,90.7 118.75,92 | R25.2 125,92.75 | R32.2 131.5,92.75 | U3.IN 84.9,15.15 C3.1
  Bottom 1.27: v79.5,81.5 77,84 77,92.75 | J4.5 130.91,20.16 v131.5,20.75 | v120.75,23.5 104.75,23.5 87.75,23.5 86,21 84.96,19.96 U3.IN
  Bottom 2.54: 19.96,27.79 19.25,28.5 19.25,63.5 v19,63.5 | v17.25,63.5 v19,63.5 | v20.75,63.5 v19,63.5
  pour Bottom: 14,17 30.5,17 30.5,6 35.75,6 35.75,36.75 23.75,36.75 23.75,67 14,67
A10
  Top 0.2: J3.2 102,24 103,25 103,40.5 102.5,41 102,41 101.5,41.5 101.5,42.82 101.05,43.26 101.05,43.9 U$1.A10
  Bottom 0.406: Z4.C 102,15.35 J3.2
A11
  Top 0.2: U$1.A11 98.96,43.45 98.96,41.94 99,41.89 99,34.5 96.5,32 96.5,16.5 98,15 98,4.5 99,3.5 101.5,3.5 102,4 J2.2
  Bottom 0.406: Z2.C 102,5.6 J2.2
A21/DAC0  (via drill 0.35)
  Top 0.2: J3.1 97.5,17.5 v97.5,27.75 | v72.5,30 71.75,30 71.5,30.25 71.5,39 69.55,40.95 U$1.21/DAC0
  Bottom 0.2: v72.5,30 80.5,30 82,29 82,28.75 83.25,27.5 97.25,27.5 v97.5,27.75
  Bottom 0.406: Z3.C J3.1
A22/DAC1  (via drill 0.35)
  Top 0.2: J2.1 100,12.5 101,13.5 101,27.84 v100.92,27.92 | v73.5,32.5 72.5,33.5 72.5,41.97 U$1.A22/DAC1
  Bottom 0.2: v73.5,32.5 77.5,32.5 77.64,32.64 79.99,32.64 83.14,29.5 83.14,28.61 83.75,28 96.8,28 97.22,28.43 100.41,28.43 v100.92,27.92
  Bottom 0.406: Z5.C J2.1
AMBER  (via drill 0.35)
  Top 0.2: v62,47.25 61.93,47.07 U$1.37/A18
  Bottom 0.2: LED2.K 50.6,42.73 51.33,43.45 56.7,43.45 60.5,47.25 v62,47.25
CMD_ACK  (via drill 0.35)
  Top 0.2: U$1.39/A20 67.01,43.51 67.75,44.25 67.75,47.5 68,47.75 v67.75,47.75 | v117.25,13.75 117.25,46.75 115.5,48.5 115.5,52 v115,52.5
  Bottom 0.2: v67.75,47.75 68,48 R36.2 | R37.2 89.66,49.3 92.31,51.95 101.7,51.95 102.25,52.5 v115,52.5 | SJ1.1 120.74,13.75 v117.25,13.75
  Bottom 0.406: R36.2 R37.2
CMD_ACK_LOCAL
  Bottom 0.2: Q6.1 66.74,55.35 U$1.27
D1
  Bottom 0.406: U2.14 59.08,32.08 56.25,29.25 56.03,29.03 55.88,28.88 IC5.8
D2
  Bottom 0.406: U2.13 59.8,30.8 58.42,29.42 IC5.7
D3
  Bottom 0.406: U2.12 60.53,29.54 59.08,28.08 59.08,23.67 60.96,21.79 IC5.6
D4
  Bottom 0.406: U2.11 60.52,28.27 59.75,27.5 59.75,24.25 61,23 62.75,23 63.5,22.25 IC5.5
D5
  Bottom 0.406: U2.10 61.26,27 61.25,27 60.75,26.5 60.75,24.5 61.5,23.75 63.37,23.75 64.61,22.5 65.75,22.5 66,22.25 66,20.6 IC5.4
D6
  Bottom 0.406: U2.9 63.8,24.25 64.86,24.25 65.86,23.25 67.75,23.25 68.6,22.4 68.6,20.57 IC5.3
D7
  Bottom 0.406: U2.7 70,27 71.12,25.88 IC5.2
D8
  Bottom 0.406: U2.6 69.98,28.27 72.75,25.5 72.75,23.5 73.66,22.59 IC5.1
DCCIN  (via drill 0.35)
  Top 0.2: OK1.6 50.17,27.33 49.5,28 49.5,51 v50,51.5 | v102.5,51.5 102.5,57.55 U$1.2
  Bottom 0.2: v50,51.5 58,51.5 | 58,51.5 63.99,51.5 64.03,51.47 65.53,51.47 66.75,50.25 66.75,48.39 66.95,48.19 66.95,47.55 67.5,47 88,47 92.5,51.5 v102.5,51.5 | R3.1 59,52.75 58.5,52.25 58.5,52 58,51.5
ENT1-2  (via drill 0.35)
  Top 0.2: U$1.25 67.17,60 v60.5,60
  Bottom 0.2: R5.2 44.5,76.12 44.5,61.5 45,61 55.02,61 55.85,60.17 57.15,60.17 57.98,61 59.5,61 v60.5,60
ENT1A  (via drill 0.35)
  Top 0.2: IC1.2 16.54,80 29.5,80 v30,79.5
  Bottom 0.2: U$1.29 59.39,57.39 59.5,58.5 58.73,59.27 55.48,59.27 54.8,59.95 33.82,59.95 33.49,60.28 32.13,60.28 31.38,61.03 31.38,62.4 30,63.77 v30,79.5
ENT1B
  Bottom 0.2: IC1.7 17,66.84 17,65.62 17.5,65.12 25.12,65.12 26.18,66.17 27.82,66.17 27.82,63.9 30.27,61.45 30.27,60.58 31.67,59.17 32.55,59.17 33.52,58.2 39.48,58.2 40.11,58.83 55.65,58.83 U$1.30
ENT2A  (via drill 0.35)
  Top 0.2: IC1.10 26.35,68.65 27,68 v27,65.5 | v28.5,41.5 v28.5,57.5
  Bottom 0.2: v28.5,57.5 28,58 28,63.08 27.37,63.71 27.37,65.13 v27,65.5 | U$1.14/A0 78.59,43.5 58.61,43.5 57.92,42.82 57.92,41.94 57.3,41.31 56.41,41.31 55.78,41.94 55.38,41.94 54.76,41.31 53.87,41.31 53.24,41.94 52.84,41.94 52.22,41.31 51.33,41.31 51.13,41.5 47.09,41.5 46.68,41.09 45.32,41.09 44.91,41.5 v28.5,41.5
ENT2B  (via drill 0.35)
  Top 0.2: IC1.15 29.65,81.35 v30.5,80.5 | U$1.15/A1 82.25,44.25 81.5,44.75 77.5,44.75 76,46.25 76,60.25 75.7,60.55 v75.5,60.55
  Bottom 0.2: v30.5,80.5 30.5,79.95 30.68,79.78 30.68,79.22 30.5,79.05 30.5,63.91 32.05,62.36 32.05,62.01 31.82,61.78 31.82,61.22 32.22,60.83 32.78,60.83 32.88,60.73 33.68,60.73 33.91,60.5 54.89,60.5 55.66,59.73 59.27,59.73 60,59 61.5,59 63.05,60.55 v75.5,60.55
ENT3-4  (via drill 0.35)
  Top 0.2: U$1.24 v72.09,64.59
  Bottom 0.2: v72.09,64.59 76.09,64.59 77.5,66 77.5,78.04 R7.2
ENT3A  (via drill 0.35)
  Top 0.2: IC2.2 45.35,81.35 v45,81 | U$1.21/A7 97.12,42.38 93.7,45.8 84.31,45.8 83.86,46.25 81.25,46.25 81,46.5 81,61 v80.5,61.5
  Bottom 0.2: v45,81 45,63 46.55,61.45 55.28,61.45 55.38,61.35 55.38,61.28 56.03,60.62 56.97,60.62 57.79,61.45 64.45,61.45 64.5,61.5 77.86,61.5 78.31,61.05 78.69,61.05 78.96,61.33 79.28,61.33 79.45,61.5 v80.5,61.5
ENT3B  (via drill 0.35)
  Top 0.2: U$1.20/A6 91.98,45.35 79.15,45.35 78.5,46 78.5,61.5 v79,62
  Bottom 0.2: IC2.7 53,66.84 53,63 54,62 55.36,62 55.83,61.54 55.83,61.47 56.22,61.08 56.78,61.08 57.17,61.47 57.17,61.97 57.2,62 v79,62
ENT4A  (via drill 0.35)
  Top 0.2: U$1.23/A9 101.5,43.45 101.5,44.47 101.5,44.48 101.5,45.37 101.5,45.75 100.5,46.75 87,46.75 86,47.75 v86,60.75
  Bottom 0.2: IC2.10 57,66.84 57,63 57.5,62.5 78.55,62.5 78.72,62.67 82.37,62.67 82.97,62.08 83.53,62.08 84.11,61.5 85.25,61.5 v86,60.75
ENT4B  (via drill 0.35)
  Top 0.2: IC2.15 66.15,81.35 v66.5,81 | U$1.22/A8 100.03,43.4 98.96,44.48 98.96,45.29 98,46.25 84.5,46.25 83.47,47.27 83.47,62.52 v83.25,62.75
  Bottom 0.2: v66.5,81 66.5,64.5 68.05,62.95 78.36,62.95 78.53,63.12 82.88,63.12 v83.25,62.75
ENT5-6  (via drill 0.35)
  Top 0.2: U$1.12/MISO 77.17,60.67 77.25,60.75 v77.5,60.75
  Bottom 0.2: R9.2 110.57,76.78 110.08,76.28 110.08,74.32 111.79,72.6 111.79,63.29 110,61.5 94.5,61.5 | 94.36,61.5 94.5,61.5 | 94.5,61.5 93.25,60.25 87.25,60.25 87,60 85.64,60 84.89,60.75 79.02,60.75 78.87,60.6 78.13,60.6 77.98,60.75 v77.5,60.75
ENT5A  (via drill 0.35)
  Top 0.2: U$1.10/CS 82.25,63.29 v81.39,64.14 | v81,82.5 82.15,81.35 IC3.2
  Bottom 0.2: v81,82.5 81.39,82.11 v81.39,64.14
ENT5B  (via drill 0.35)
  Top 0.2: v84.5,63.75 84.5,57.91 U$1.9/CS
  Bottom 0.2: v84.5,63.75 87.25,63.75 88,64.5 88,68 87.35,68.65 IC3.7
ENT6A  (via drill 0.35)
  Top 0.2: U$1.7 89.87,60.87 v90.5,61.5
  Bottom 0.2: IC3.10 93.65,68.65 92,67 92,63.5 90.5,62 v90.5,61.5
ENT6B  (via drill 0.35)
  Top 0.2: U$1.8 87.33,61.33 87.5,61.5 v87.75,61.5
  Bottom 0.2: IC3.15 93.35,81.35 92.5,80.5 92.5,79.47 92.24,79.21 92.24,67.88 91.5,67.14 91.5,64 89,61.5 v87.75,61.5
ENT7-8  (via drill 0.35)
  Top 0.2: v127,58 127,52.75 126.5,52.25 v126.62,52.12
  Bottom 0.2: R11.2 145.32,79.18 141.47,75.08 140.58,75.08 140.5,75 140.25,75 136.81,71.55 136.81,65.4 136.93,65.28 136.93,64.72 136.81,64.6 136.81,59.81 135,58 v127,58 126.75,58 | U$1.11/MOSI 84.08,53.25 123.16,53.25 123.66,52.75 125.05,52.75 125.47,52.33 126.42,52.33 v126.62,52.12 126.75,52
ENT7A  (via drill 0.35)
  Top 0.2: IC4.2 115.85,81.35 v115.5,81
  Bottom 0.2: v115.5,81 115.5,67.48 114.55,66.53 114.55,61.55 113.95,60.95 96.31,60.95 94.86,59.5 93,59.5 92.41,58.91 U$1.6
ENT7B
  Bottom 0.2: IC4.7 119.64,67.1 115.75,67.1 115,66.34 115,61 114.5,60.5 96.5,60.5 94.95,58.95 U$1.5
ENT8A
  Bottom 0.2: U$1.3/CANTX 101.91,59.5 126,59.5 127,60.5 127,68 127.65,68.65 IC4.10
ENT8B
  Bottom 0.2: U$1.4/CANRX 99.87,60 125,60 126.5,61.5 126.5,68.3 126.67,68.47 126.67,71.02 127.8,72.15 130.15,72.15 131.5,73.5 131.5,77.5 131.15,77.85 127.8,77.85 127.24,78.41 127.24,79.21 127.8,79.77 128.39,79.77 128.81,80.19 IC4.15
EVAL_ACK  (via drill 0.35)
  Top 0.2: v69.75,53.25 67.01,55.99 U$1.26
  Bottom 0.2: D1.3 71.65,53.25 v69.75,53.25
  Bottom 0.406: R37.1 D1.3
GND  (via drill 0.35)
  Top 0.61: 19.75,19.45 19.75,19.75
  Bottom 0.61: 19.66,21.16 v19.66,21.1 U1.4
  Bottom 1.016: U3.GND 87.44,15.49 | 87.44,15.49 C3.2 | 87.44,15.49 87.93,15 C2.2 89.05,13.95 89.75,13.25 93.02,13.25 C6.-
  other vias: 18.25,79 18.25,76.25 18.25,73.75 34,76.25 41.25,76.25 38.75,76.25 36.25,76.25 18.25,71.25 18.25,68.75 20,68.75 20,71.25 20,73.75 20,76.25 20,79 54,79 55.75,79 54,76.25 55.75,76.25 54,73.75 55.75,73.75 55.75,71.25 54,71.25 54,68.75 55.75,68.75 68.75,76.25 71.25,76.25 73.75,76.25 76,76.25 89,79 91,79 89,76.25 89,73.75 89,71.25 89,68.75 91,68.75 91,71.25 91,73.75 91,76.25 104.5,76 106.5,76 108.75,76 110.75,76 123.75,78.75 126,78.75 123.75,76.25 126,76.25 124,73.75 126,73.75 124,71.25 126,71.25 124,68.75 126,68.75 139,76 141.25,76 144,76 146.25,76 99.25,27.25 100,19.5 100.5,33.25 97.25,47.75
  pour Top: 0.5,99.5 159.5,99.5 159.5,0.5 35.5,0.5 35.5,10.25 48,10.25 48,35.25 33,35.25 33,14.25 14,14.25 14,0.25 0.5,0.25
  pour Bottom: 0.5,99.5 159.5,99.5 159.5,0.5 48,0.5 48,39 24.75,39 24.75,67.5 13.5,67.5 13.5,0.25 0.5,0.25
INT  (via drill 0.35)
  Top 0.2: v133.5,40 133.5,43.5 132.08,44.92 JP3.10
  Bottom 0.2: U$1.16/A2 84.79,40.71 85.05,40.45 123.19,40.45 124.14,39.5 133,39.5 v133.5,40
KEY  (via drill 0.35)
  Top 0.2: JP3.7 126.96,47.46 126,46.5 v126,40.5
  Bottom 0.2: U$1.17/A3 87.33,41.67 88.1,40.9 123.37,40.9 124.27,40 125.5,40 v126,40.5
N$1  (via drill 0.35)
  Top 0.61: U$1.AREF 102.5,44.99 v102.5,47
  Bottom 0.406: L1.2 v102.5,47 101.3,47 C5.1
N$2
  Bottom 0.508: R1.1 33,29.25 34.3,30.55 D7.C 39.9,30.55 C1.1 43.45,29.7 43.62,29.87 OK1.2
  Bottom 1.016: C1.1 41.2,29.7
N$3
  Bottom 0.61: U1.8 15.85,10.75 Z1.1 | U1.7 17.11,10.75 17.48,10.75 18.5,10.75 18.5,10.25 18.39,10.25 U1.6 | U1.5 19.66,10.75 19.75,10.75
  Bottom 2.54: X9.3 17.48,10.75 | 17.48,10.75 Z1.1 | 19.75,10.75 17.48,10.75
N$4
  Bottom 1.016: OK1.7 54.37,29.87 55,30.5 R2.1
N$5
  Bottom 0.61: Q2.B 75.04,82.4 R7.1
N$7
  Bottom 0.61: R5.1 40.57,85.43 40,86 40,88.31 Q1.B
N$8  (via drill 0.35)
  Top 1.016: v37.5,96.5 Q1.C
  Bottom 0.61: D3.C 38.25,84 37.5,84.75 Q1.C
  Bottom 1.016: X1.2 14.75,97.25 15.5,98 25.5,98 | v37.5,96.5 36,98 25.5,98 | X1.5 25.25,97.75 25.5,98
N$9
  Bottom 1.016: LED5.A 18.07,89.05 R19.1
N$10  (via drill 0.35)
  Top 1.016: v125.83,22.32 126,22.25 v140.25,22.25
  Bottom 0.2: 140.7,17.51 J5.1
  Bottom 1.016: J5.1 140.82,21.93 140.5,22.25 v140.25,22.25 | J4.1 v125.83,22.32
  Bottom 1.27: 140.7,17.51 SJ2.2
N$11
  Bottom 0.406: Q6.3 R36.1
N$12  (via drill 0.35)
  Top 1.016: v72.5,96.75 Q2.C
  Bottom 0.61: D4.C 73,85 72.5,85.5 Q2.C
  Bottom 1.016: X2.2 49.75,97.5 50.25,98 60.5,98 | 60.5,98 71.25,98 v72.5,96.75 | X2.5 60.25,97.75 60.5,98
N$13
  Bottom 1.016: R20.1 66.22,88.8 LED6.A
N$14
  Bottom 1.016: LED7.A 53.22,88.8 R21.1
N$15
  Bottom 1.016: R22.1 101.22,88.8 LED8.A
N$16
  Bottom 1.016: R23.1 88.47,88.55 LED9.A
N$17
  Bottom 0.406: LED10.A 136.47,88.55 R24.1
N$18
  Bottom 1.016: R25.1 123.72,88.55 LED11.A
N$19
  Bottom 1.016: LED12.A 26.45,89 R26.1
N$20
  Bottom 0.61: R9.1 110.57,85.43 110,86 110,88.31 Q3.B
N$22  (via drill 0.35)
  Top 1.016: v107.5,96.75 Q3.C
  Bottom 0.61: D6.C 108.25,85.25 107.5,86 Q3.C
  Bottom 1.016: X3.2 84.75,97.25 85.5,98 95,98 | 95,98 106.25,98 v107.5,96.75 | X3.5 95.25,97.75 95,98
N$23
  Bottom 1.016: LED13.A 13.45,89 R27.1
N$24
  Bottom 1.016: LED14.A 59.72,88.8 R28.1
N$25
  Bottom 1.016: LED15.A 46.72,88.8 R29.1
N$26
  Bottom 1.016: R30.1 94.97,88.55 LED16.A
N$27
  Bottom 0.61: R11.1 145.32,85.68 145,86 145,88.31 Q4.B
N$28  (via drill 0.35)
  Top 0.406: v132.75,12 146.25,12 147.18,12.93 J5.6
  Bottom 0.2: 132.5,12 v132.75,12
  Bottom 0.406: J4.6 132.18,12.32 132.5,12 | SJ1.2 124.25,12.75 125,12 v132.75,12
N$29
  Bottom 0.61: D5.C 143,85.5 142.5,86 Q4.C
  Bottom 1.016: 130.25,98 120.5,98 119.75,97.25 X4.2 | 130.25,98 141.25,98 142.5,96.75 Q4.C | X4.5 130.25,98
N$30
  Bottom 1.016: R31.1 81.97,88.55 LED17.A
N$31
  Bottom 0.406: LED18.A 129.97,88.55 R32.1
N$32
  Bottom 1.016: R33.1 117.22,88.55 LED19.A
N$33
  Bottom 0.406: JP2.2 137.68,27.02 R35.2
N$38
  Top 1.27: IC5.10 51.75,11.27 X11.4
  Bottom 1.016: X10.2 88.75,3.25 88,2.5 81.75,2.5 | 81.75,2.5 74.5,2.5 | 74.5,2.5 58.75,2.5 | 58.75,2.5 51.75,2.5 | 51.75,2.5 44.75,2.5 | 44.75,2.5 34.41,2.5 F1.2 | X11.6 44.75,2.5 | X11.4 51.75,2.5 | X11.2 58.75,2.5 | X10.6 74.75,2.75 74.5,2.5 | X10.4 81.75,2.5
N$42
  Bottom 0.2: R15.1 45.98,57.25 LED3.A
N$43
  Bottom 0.2: R13.1 45.43,51.27 LED1.A
N$44
  Bottom 0.2: LED2.A 45.98,45.25 R14.1 43,45.25
N$47
  Bottom 1.016: LED4.A 32.95,89 R18.1
O1
  Bottom 0.61: X11.7 41.25,7 42.25,8 52.75,8 55.88,11.13 IC5.11
O2
  Bottom 0.61: X11.5 48.25,6 49.25,7 53.85,7 55.91,9.06 56.81,9.06 58.42,10.67 IC5.12
O3
  Bottom 0.61: X11.3 55.5,5.35 55.5,6.5 57.25,8.25 59.75,8.25 60.96,9.46 IC5.13
O4
  Bottom 0.61: X11.1 62.25,6.75 63.5,8 IC5.14
O5
  Bottom 0.61: X10.7 71.25,6.5 70.75,7 67.5,7 66.38,8.12 66.19,8.31 66.04,8.46 IC5.15
O6
  Bottom 0.61: X10.5 78.25,7 77.25,8 69.25,8 68.58,8.67 IC5.16
O7
  Bottom 0.61: X10.3 85.25,7.25 83.5,9 72.5,9 71.12,10.38 IC5.17
O8
  Bottom 0.61: X10.1 92.25,8.25 90.5,10 74.75,10 73.66,11.09 IC5.18
OC1-2  (via drill 0.35)
  Top 0.2: v31.5,44.5 32,45 32,61 v32.5,61.5
  Bottom 0.2: 34,84.25 34.55,84.25 R4.2 32.5,81.3 v32.5,61.5 | v31.5,44.5 33.62,42.38 44.67,42.38 45.51,41.54 46.49,41.54 47.23,42.28 50.88,42.28 50.98,42.38 U$1.33/A14
  Bottom 1.016: Q1.E 34.96,85.21 34,84.25
OC3-4  (via drill 0.35)
  Top 0.2: U$1.34/A15 56,44.07 56,56.95 55.78,57.17 55.78,58.06 56,58.29 56,61.5 56.25,61.5 v56.5,61.75
  Bottom 0.2: R6.2 68.8,85 65.5,85 64.5,84 64.5,70.5 64,70 57.5,70 57,69.5 57,68 56,67 56,62 56.25,61.75 v56.5,61.75
  Bottom 1.016: Q2.E 69.96,83.84 R6.2
OC5-6  (via drill 0.35)
  Top 0.2: v91,47.5 91,60 v92.38,61.38
  Bottom 0.2: R8.2 100.55,79.6 100.55,72.07 100.5,72.02 100.5,64 99,62.5 93.5,62.5 v92.38,61.38 92,61 | U$1.35/A16 60.46,45.99 64.92,45.99 65.66,45.25 88.5,45.25 90.75,47.5 v91,47.5
  Bottom 1.016: Q3.E 104.96,84.09 R8.2
OC7-8  (via drill 0.35)
  Top 0.2: 139.96,85.52 Q4.E | v138.75,47 138.75,53.5 136.25,56 v136.25,65
  Bottom 0.2: R10.2 136.25,80.05 v136.25,65 | U$1.36/A17 60.65,41.12 61.22,41.12 61.34,41 80.5,41 81,41.5 81,44 81.8,44.8 88.69,44.8 89.39,45.5 94.5,45.5 96.25,43.75 114.25,43.75 116.5,46 128.24,46 128.27,46.03 137.78,46.03 v138.75,47
  Bottom 1.016: Q4.E 139.96,83.84 R10.2
OT1A
  Top 1.016: X1.3 18.25,93.25 17.5,92.5 16,92.5 15.48,91.98 LED5.K
  Bottom 1.016: IC1.3 13.69,78.81 12,80.5 12,85 13.5,86.5 14.5,86.5 15.5,87.5 15.48,87.52 LED5.K
OT1B
  Top 1.016: X1.1 10.4,94.9 9,93.5 9,89.02 LED13.K
  Bottom 1.016: IC1.6 11.31,71.19 9,73.5 9,88.98 LED13.K
OT2A
  Top 1.016: LED4.K 28.48,94.63 X1.6
  Bottom 1.016: LED4.K 28.48,87.98 27,86.5 27,73.5 24.69,71.19 IC1.11
OT2B
  Top 1.016: LED12.K 21.98,94.67 X1.4
  Bottom 1.016: IC1.14 24.31,78.81 25.5,80 25.5,86 24.5,87 22.5,87 21.98,87.52 LED12.K
OT3A
  Top 1.016: X2.3 50.48,92.13 LED7.K
  Bottom 1.016: IC2.3 49.19,78.81 48.25,79.75 48.25,84.25 50.5,86.5 50.5,88.98 LED7.K
OT3B
  Top 1.016: X2.1 43.98,92.63 LED15.K
  Bottom 1.016: IC2.6 48.06,71.19 46.75,72.5 46.75,84.25 43.98,87.02 LED15.K
OT4A
  Top 1.016: X2.6 63.48,94.63 LED6.K
  Bottom 1.016: IC2.11 61.19,71.19 63,73 63,86 63.5,86.5 63.5,88.98 LED6.K
OT4B
  Top 1.016: X2.4 56.75,89.23 LED14.K
  Bottom 1.016: IC2.14 60.81,78.81 61.5,79.5 61.5,85.25 60.75,86 57.75,86 57,86.75 57,88.98 LED14.K
OT5A
  Top 1.016: X3.3 88.25,93.75 85.5,91 85.5,89.02 LED9.K
  Bottom 1.016: IC3.3 84.19,78.81 83.75,79.25 83.75,84.75 85.5,86.5 85.5,88.98 LED9.K
OT5B
  Top 1.016: LED17.K 78.98,92.63 X3.1
  Bottom 1.016: 79,88.98 LED17.K 78.98,87.02 82.25,83.75 82.25,72.5 83.56,71.19 IC3.6
OT6A
  Top 1.016: X3.6 98.75,89.27 LED8.K
  Bottom 1.016: LED8.K 98.48,73.98 95.69,71.19 IC3.11
OT6B
  Top 1.016: X3.4 91.75,89.23 LED16.K
  Bottom 1.016: LED16.K 91.98,86.77 93,85.75 95.75,85.75 97,84.5 97,80.25 95.56,78.81 IC3.14
OT7A
  Top 1.016: X4.3 123.25,92.75 120.48,90.23 LED11.K
  Bottom 1.016: IC4.3 119.44,78.81 119,79.25 119,85 120.5,86.5 120.5,88.98 LED11.K
OT7B
  Top 1.016: X4.1 113.98,92.63 LED19.K
  Bottom 1.016: LED19.K 113.98,87.27 117.25,84 117.25,73 119.06,71.19 IC4.6
OT8A
  Top 1.016: X4.6 133.73,94.88 LED10.K
  Bottom 1.016: LED10.K 133.48,73.48 131.19,71.19 IC4.11
OT8B
  Top 1.016: LED18.K 126.98,92.27 126.75,92.5 X4.4
  Bottom 1.016: IC4.14 130.56,78.81 131,79.25 131,85 130.5,86 127.5,86 127,86.5 127,88.98 LED18.K
RED  (via drill 0.35)
  Top 0.2: U$1.38/A19 64.47,43.53 64.75,43.75 65.75,43.75 66.5,44.5 v66.5,46.5
  Bottom 0.2: LED1.K 65.77,48.73 66.5,48 v66.5,46.5
RX
  Bottom 0.2: JP3.1 128.65,55 127.5,55 126,56.5 123.25,56.5 122.92,56.83 110.92,56.83 110.64,56.55 109.75,56.55 109.46,56.83 108.44,56.83 U$1.0/RX
SCL  (via drill 0.35)
  Top 0.2: J1.1 113,12.05 113.86,13.19 113.86,35.64 v113.5,36 | U$1.18/A4/SDA 89.87,38.87 89,38 v89,37.5 | v138,37 138,53 135.92,55.08 JP3.2
  Bottom 0.2: U2.1 70,34.62 70.5,35.12 70.5,36.5 71.05,37.05 76.45,37.05 76.47,37.02 88.16,37.02 88.64,37.5 v89,37.5 89.07,37.43 91.93,37.43 93.36,36 v113.5,36 114,35.5 134.5,35.5 135.04,36 135.72,36.67 137.68,36.67 v138,37
  Bottom 0.406: Z7.C 110.5,5.75 111.25,5 J1.1
  Bottom 1.016: J1.1 R16.1
SDA  (via drill 0.35)
  Top 0.2: v91.19,36.55 91.14,36.5 91,36.5 91.5,37 91.5,41.47 U$1.19/A5/SCL | JP3.6 133.5,50 134.25,49.25 v134.25,34.5 | v115.25,34.5 115.25,8.75 115,8.5 J1.2
  Bottom 0.2: v134.25,34.5 v115.25,34.5 114.75,35 92.74,35 v91.19,36.55 71.55,36.55 71,36 71,34.21 70.13,33.34 U2.2
  Bottom 0.406: Z6.C 116.65,7.1 116.25,7.5 115.2,7.5 | 114.75,7.5 115.2,7.5 | 115.2,7.5 R17.1
  Bottom 1.016: J1.2 115.25,5.25 R17.1
TRACK1  (via drill 0.35)
  Top 0.61: X9.1 27.64,24.89 v28.25,25.5
  Bottom 0.61: v28.25,25.5 32.95,25.5 R1.2
  Bottom 1.016: 32.5,25.55 33.02,25.53 R1.2
TRACK2  (via drill 0.35)
  Top 0.61: X9.2 26.01,1.52 29.77,1.52 30.75,2.5 30.75,20 31.25,20.5 v39.75,20.5
  Bottom 0.508: 44.06,27.25 41.3,27.25 C1.2 39.9,26.95 D7.A
  Bottom 1.016: 41.2,27.8 C1.2 40.75,21.5 v39.75,20.5 | 44.06,27.25 OK1.3
TX
  Bottom 0.2: JP3.3 128.04,52.54 128,52.5 127,53.5 127,54 125.5,55.5 122.5,55.5 121.62,56.38 111.1,56.38 110.82,56.1 109.56,56.1 109.28,56.38 106.35,56.38 U$1.1/TX
XP_DIR  (via drill 0.35)
  Top 0.2: U$1.28 61.93,48.13 61.33,47.53 61.33,46.33 60.75,45.75 v60.75,40 | v128.5,38 128.5,34.5 129.5,33.5 v129.5,32.75
  Bottom 0.2: v128.5,38 128.25,38.25 123.89,38.25 122.59,39.55 61.24,39.55 60.79,40 v60.75,40
  Bottom 0.406: IC6.2 128.87,32.37 129.25,32.75 v129.5,32.75 130,32.75 130.13,32.62 IC6.3
XP_RX  (via drill 0.35)
  Top 0.2: U$1.31/A12 54.31,43.9 53.24,42.83 53.24,41.94 53.25,41.92 53.25,40.25 53.75,39.75 v53.75,39.5 | v127.5,33.25 v127.5,37
  Bottom 0.2: v127.5,37 127.25,37.25 124.25,37.25 122.4,39.1 54.15,39.1 v53.75,39.5 | IC6.1 127.59,33.16 v127.5,33.25
XP_TX  (via drill 0.35)
  Top 0.2: U$1.32/A13 51.77,44.27 50.7,43.2 50.7,39.05 v51.25,38.5 | v131.25,33.25 131.25,38.5 v131,38.75
  Bottom 0.2: v51.25,38.5 52.92,40.17 54.03,40.17 54.2,40 59.8,40 60.47,40.67 61.03,40.67 61.7,40 123,40 124,39 130.75,39 v131,38.75 | IC6.4 131.25,31 v131.25,33.25
XPA  (via drill 0.35)
  Top 0.2: J4.4 131.49,13 v135.25,13 144,13 144.63,13.63 J5.4
  Bottom 0.2: R12.1 150,13.75 149.25,13 145.25,13 144.75,13.5 144.75,14.73 J5.4
  Bottom 0.406: v135.25,13 135.25,24 135.02,24.48 JP2.1 134.48,24.5 133.75,24.5 132.75,23.5 130.5,23.5 130.13,23.86 IC6.6
XPB
  Top 0.2: J5.3 141.5,19.25 129,19.25 128.5,18.75 128.5,17.52 J4.3
  Bottom 0.406: J5.3 143.37,23.89 142.2,25.05 R34.2 R35.1 | IC6.7 128.87,19.61 128.37,19.11 J4.3

### Text on the board
tPlace: Term | XPressnet | IO2 | O1 | O2 | O3 | O4 | O5 | O6 | O7 | O8 | IO1 | I2C
tNames: 5V Ok | Fault | Status | DCC Accessory Board / Rev 1.0 / April 2018 | 0V | 1B | 1A | 2A | 2B | VMOT